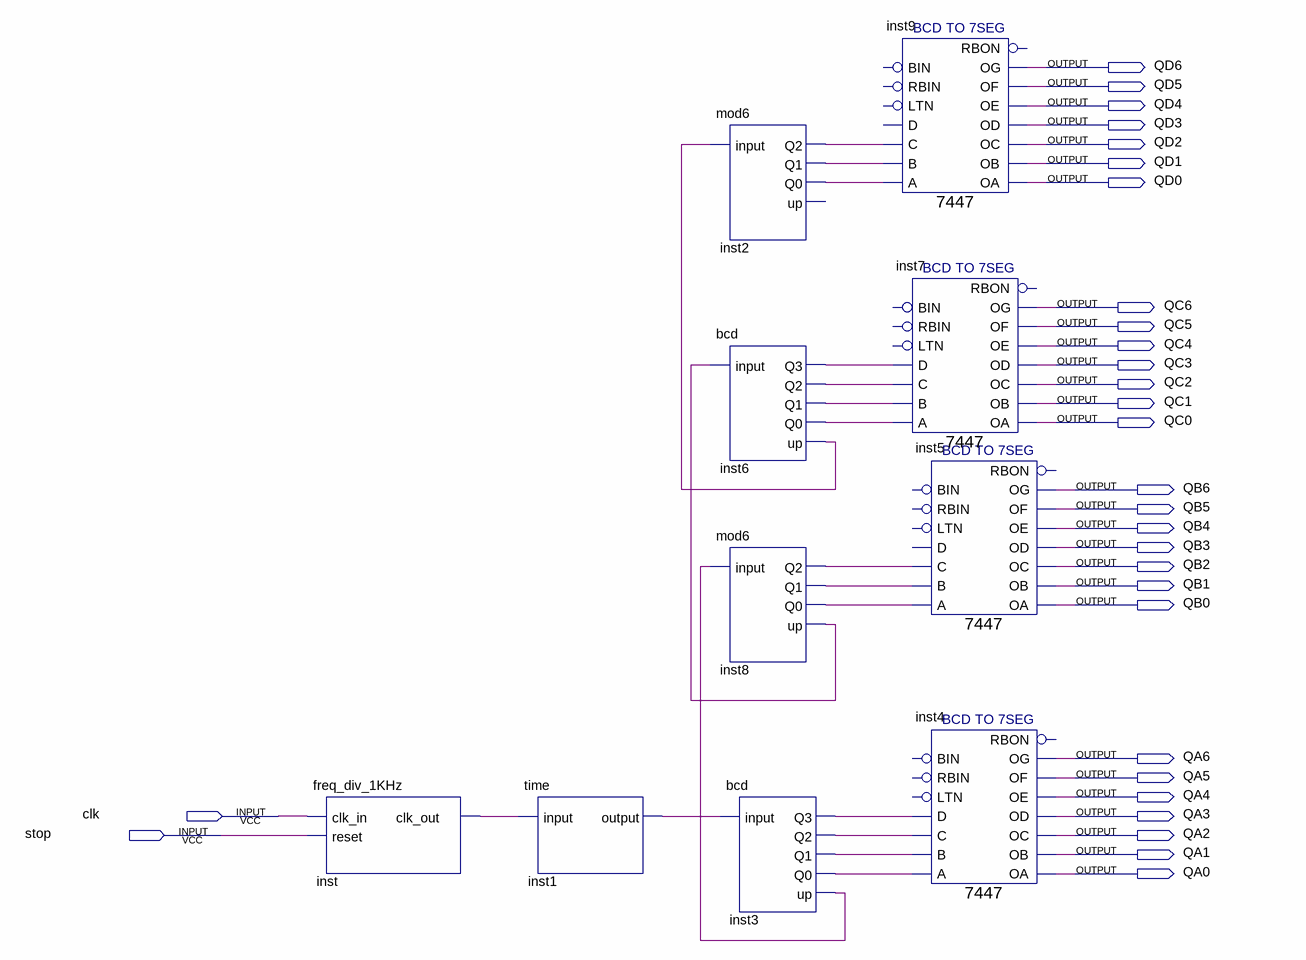
[diagram p0: schematic sheet]
// Quartus schematic midterm.bdf as structural Verilog: 10 symbols, 30 pins
module midterm (
  input  clk,
  input  stop,
  output QD6,
  output QD5,
  output QD4,
  output QD3,
  output QD2,
  output QD1,
  output QD0,
  output QC6,
  output QC5,
  output QC4,
  output QC3,
  output QC2,
  output QC1,
  output QC0,
  output QB6,
  output QB5,
  output QB4,
  output QB3,
  output QB2,
  output QB1,
  output QB0,
  output QA6,
  output QA5,
  output QA4,
  output QA3,
  output QA2,
  output QA1,
  output QA0
);

  wire inst1_output, inst2_q0, inst2_q1, inst2_q2, inst3_q0, inst3_q1, inst3_q2, inst3_q3, inst3_up,
       inst6_q0, inst6_q1, inst6_q2, inst6_q3, inst6_up, inst8_q0, inst8_q1, inst8_q2, inst8_up, inst_clk_out;

  freq_div_1KHz inst (.clk_in(clk), .reset(stop), .clk_out(inst_clk_out));
  \time  inst1 (.\input (inst_clk_out), .\output (inst1_output));
  mod6 inst2 (.\input (inst6_up), .Q2(inst2_q2), .Q1(inst2_q1), .Q0(inst2_q0));  // open: up
  bcd inst6 (.\input (inst8_up), .Q3(inst6_q3), .Q2(inst6_q2), .Q1(inst6_q1), .Q0(inst6_q0), .up(inst6_up));
  mod6 inst8 (.\input (inst3_up), .Q2(inst8_q2), .Q1(inst8_q1), .Q0(inst8_q0), .up(inst8_up));
  bcd inst3 (.\input (inst1_output), .Q3(inst3_q3), .Q2(inst3_q2), .Q1(inst3_q1), .Q0(inst3_q0), .up(inst3_up));
  \7447  inst9 (
    .B(inst2_q1), .C(inst2_q2), .A(inst2_q0), .OB(QD1), .OC(QD2), .OE(QD4), .OD(QD3), .OF(QD5), .OG(QD6),
    .OA(QD0));  // open: LTN, D, RBIN, BIN, RBON
  \7447  inst7 (
    .B(inst6_q1), .C(inst6_q2), .D(inst6_q3), .A(inst6_q0), .OB(QC1), .OC(QC2), .OE(QC4), .OD(QC3), .OF(QC5),
    .OG(QC6), .OA(QC0));  // open: LTN, RBIN, BIN, RBON
  \7447  inst5 (
    .B(inst8_q1), .C(inst8_q2), .A(inst8_q0), .OB(QB1), .OC(QB2), .OE(QB4), .OD(QB3), .OF(QB5), .OG(QB6),
    .OA(QB0));  // open: LTN, D, RBIN, BIN, RBON
  \7447  inst4 (
    .B(inst3_q1), .C(inst3_q2), .D(inst3_q3), .A(inst3_q0), .OB(QA1), .OC(QA2), .OE(QA4), .OD(QA3), .OF(QA5),
    .OG(QA6), .OA(QA0));  // open: LTN, RBIN, BIN, RBON
endmodule
